# Altium schematic sheet PIXRACER-POWER-R12.SchDoc
size A4
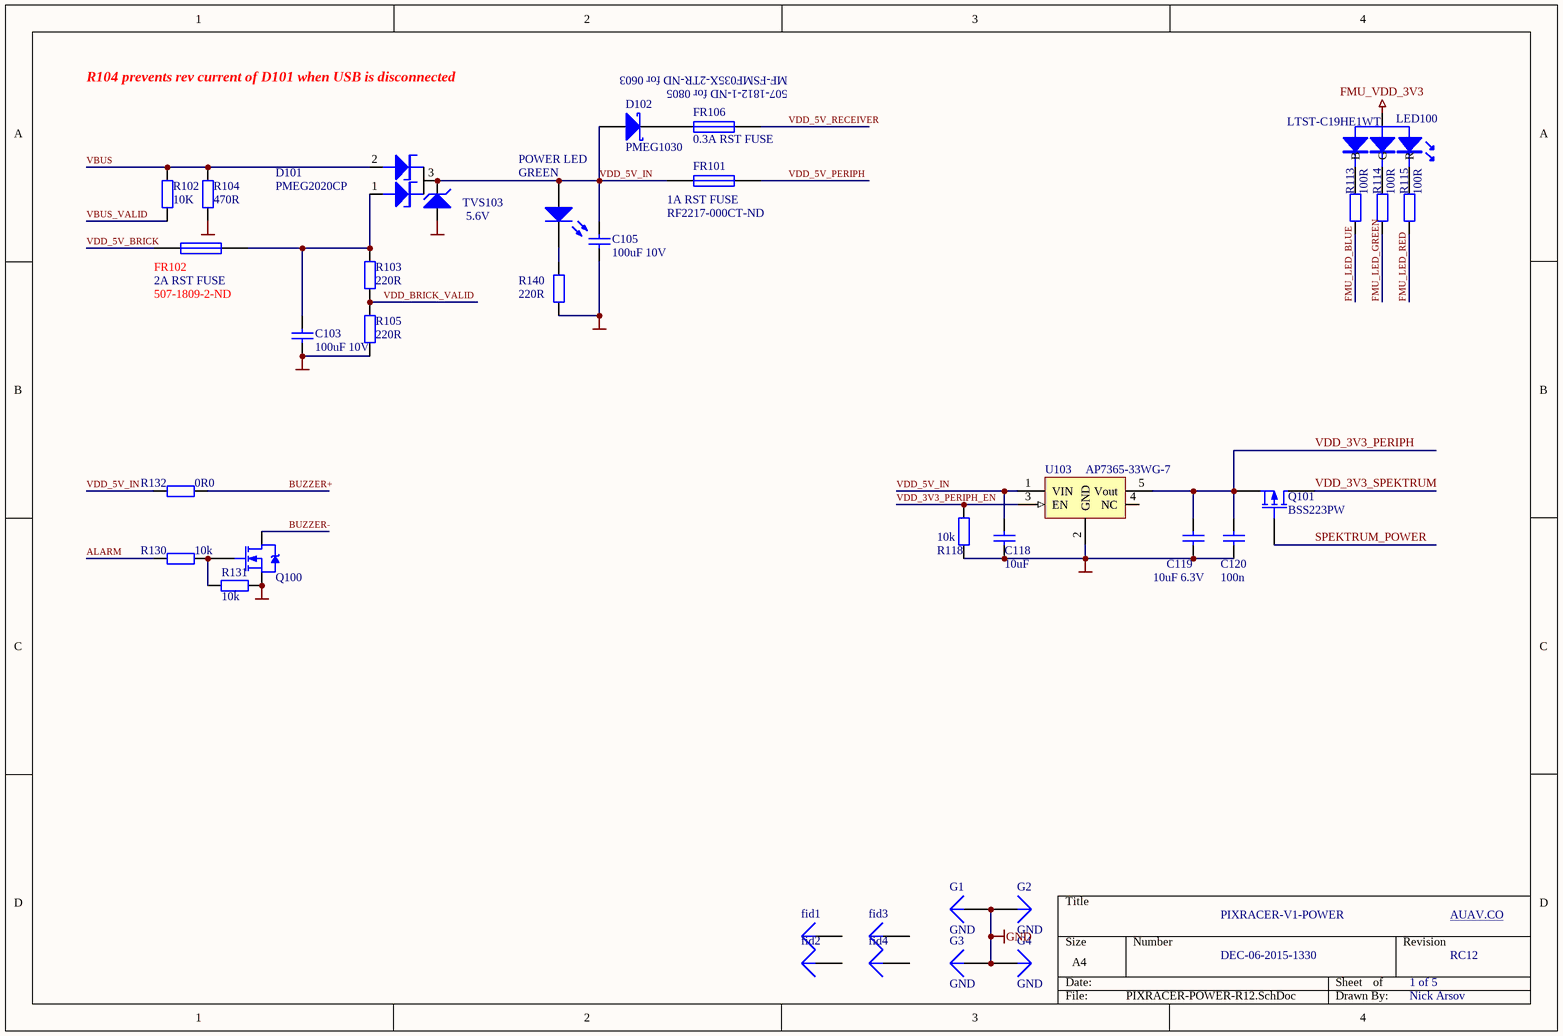
[diagram p0: PIXRACER-POWER-R12.SchDoc]

## Parts
C103  100uF 10V  [0805A]
C105  100uF 10V  [0805A]
C118  10uF  [0603A]
C119  10uF 6.3V  [0603A]
C120  100n  [0603A]
D101  PMEG2020CP  [pmeg2020cp]
D102  PMEG1030  [sod323f]
fid1  (no value)  [SMT_PAD]
fid2  (no value)  [SMT_PAD]
fid3  (no value)  [SMT_PAD]
fid4  (no value)  [SMT_PAD]
FR101  1A RST FUSE  DigiKey: RF2217-000CT-ND  [0805A]
FR102  2A RST FUSE  DigiKey: 507-1809-2-ND  [1206A]
FR106  0.3A RST FUSE  [0805A]
G1  GND
G2  GND
G3  GND
G4  GND
LED100  LTST-C19HE1WT  [LTST-C19HE1WT]
POWER_LED  GREEN  [0603A]
Q100  DMG1012UW  [2N7002-SOT323]  (value not drawn)
Q101  BSS223PW  [2N7002-SOT323]
R102  10K  [0603A]
R103  220R  [0603A]
R104  470R  [0603A]
R105  220R  [0603A]
R113  100R  [0402A]
R114  100R  [0402A]
R115  100R  [0402A]
R118  10k  [0603A]
R130  10k  [0402A]
R131  10k  [0402A]
R132  0R0  [0402A]
R140  220R  [0603A]
TVS103  5.6V  [SOD123F]
U103  AP7365-33WG-7  [SOT23-5]

## Nets
FMU_VDD_3V3: LED100.4(A)
GND: C103.1 C105.1 C118.1 C119.1 C120.1 G1.1 G2.1 G3.1 G4.1 Q100.2(S) R104.1 R105.2 R118.1 R131.2 R140.1 TVS103.1(A) U103.2(GND)
ALARM: R130.2
BUZZER+: R132.1
BUZZER-: Q100.1(D)
FMU_LED_BLUE: R113.1
FMU_LED_GREEN: R114.1
FMU_LED_RED: R115.1
SPEKTRUM_POWER: Q101.3(G)
VBUS: D101.2 R102.2 R104.2
VBUS_VALID: R102.1
VDD_3V3_PERIPH: C119.2 C120.2 Q101.2(S) U103.5(Vout)
VDD_3V3_PERIPH_EN: R118.2 U103.3(EN)
VDD_3V3_SPEKTRUM: Q101.1(D)
VDD_5V_BRICK: FR102.1
VDD_5V_IN: C105.2 C118.2 D101.3 D102.1(A) FR101.1 POWER_LED.1(A) R132.2 TVS103.2(K) U103.1(VIN)
VDD_5V_PERIPH: FR101.2
VDD_5V_RECEIVER: FR106.2
VDD_BRICK_VALID: R103.2 R105.1
NetC103_2: C103.2 D101.1 FR102.2 R103.1
NetD102_2: D102.2(K) FR106.1
NetLED100_1: LED100.1(R) R115.2
NetLED100_2: LED100.2(G) R114.2
NetLED100_3: LED100.3(B) R113.2
NetPOWER_LED_2: POWER_LED.2(K) R140.2
NetQ100_3: Q100.3(G) R130.1 R131.1

Not connected (* = marked no-connect by the designer): fid1 1; fid2 1; fid3 1; fid4 1; U103 4(NC)

## Notes on the sheet
- R104 prevents rev current of D101 when USB is disconnected
- 507-1812-1-ND for 0805
- MF-FSMF035X-2TR-ND for 0603
- PIXRACER-V1-POWER
- AUAV.CO
- DEC-06-2015-1330
- 1 of 5
- RC12
- Nick Arsov

## Library data of the parts
C103 C105 C118-C120 = Cap: Capacitor; Value: 100pF; Published: 8-Jun-2000; LatestRevisionDate: 17-Jul-2002; LatestRevisionNote: Re-released for DXP Platform.; PackageReference: RAD-0.3; Publisher: Altium Limited; PackageDescription: Radial Cap, Thru-Hole; 2 Leads; 0.3 in Pin Spacing
D102 = D Schottky: Schottky Diode; Published: 8-Jun-2000; LatestRevisionDate: 17-Jul-2002; LatestRevisionNote: Re-released for DXP Platform.; PackageReference: SMB; Publisher: Altium Limited; PackageDescription: DO-214-AA/SMB; 2 C-Bend Leads; Body 5.3 x 3.6 mm, inc. leads (LxW); Code_JEDEC: DO-214-AA
fid1-fid4 G1-G4 = Plug: LatestRevisionDate: 17-Jul-2002; LatestRevisionNote: Re-released for DXP Platform.; Publisher: Altium Limited
FR101 FR102 FR106 = Fuse 1: Fuse; Published: 8-Jun-2000; LatestRevisionDate: 17-Jul-2002; LatestRevisionNote: Re-released for DXP Platform.; PackageReference: PIN-W2/E2.8; Publisher: Altium Limited; PackageDescription: Thru-Hole; 2 Leads
LED100 = RGB_LED_5MM
POWER_LED = LED0: Typical INFRARED GaAs LED; Published: 8-Jun-2000; LatestRevisionDate: 08-Jul-2005; LatestRevisionNote: Mech Layer 1 removed.; PackageReference: LED-0; Publisher: Altium Limited; PackageDescription: LED; 2 Leads
Q100 = NMOS-2: N-Channel Power MOSFET; Note: Pin 2 is electrically connected to pin 4.; Published: 8-Jun-2000; LatestRevisionDate: 17-Jul-2002; LatestRevisionNote: Re-released for DXP Platform.; DatasheetDocument: PD-9.814; PackageReference: TO-220AB; Publisher: Altium Limited; Code_JEDEC: TO-220-AB; ComponentLink1Description: Manufacturer Link; ComponentLink1URL: http://www.irf.com/
Q101 = MOSFET-P: P-Channel MOSFET; Published: 8-Jun-2000; LatestRevisionDate: 17-Jul-2002; LatestRevisionNote: Re-released for DXP Platform.; PackageVersion: 1995/1996; PackageReference: E3; Publisher: Altium Limited; PackageDescription: TO, Flat Index; 3 In-Line, Axial Leads; Body Dia. 4.6mm; Lead Dia. 0.5 mm (max)
R102-R105 R113-R115 R118 R130-R132 R140 = Res2: Resistor; Value: 1K; Published: 8-Jun-2000; LatestRevisionDate: 17-Jul-2002; LatestRevisionNote: Re-released for DXP Platform.; PackageReference: AXIAL-0.4; Publisher: Altium Limited
  R102-R105 R118 R130-R132 R140: PackageDescription: Axial Device, Thru-Hole; 2 Leads; 0.4 in Pin Spacing
TVS103 = D Zener: Zener Diode; Published: 8-Jun-2000; LatestRevisionDate: 17-Jul-2002; LatestRevisionNote: Re-released for DXP Platform.; PackageReference: DIODE-0.7; Publisher: Altium Limited; PackageDescription: Diode, Thru-Hole; 2 Leads; 0.7 in Pin Spacing
U103 = LP5907-Q1